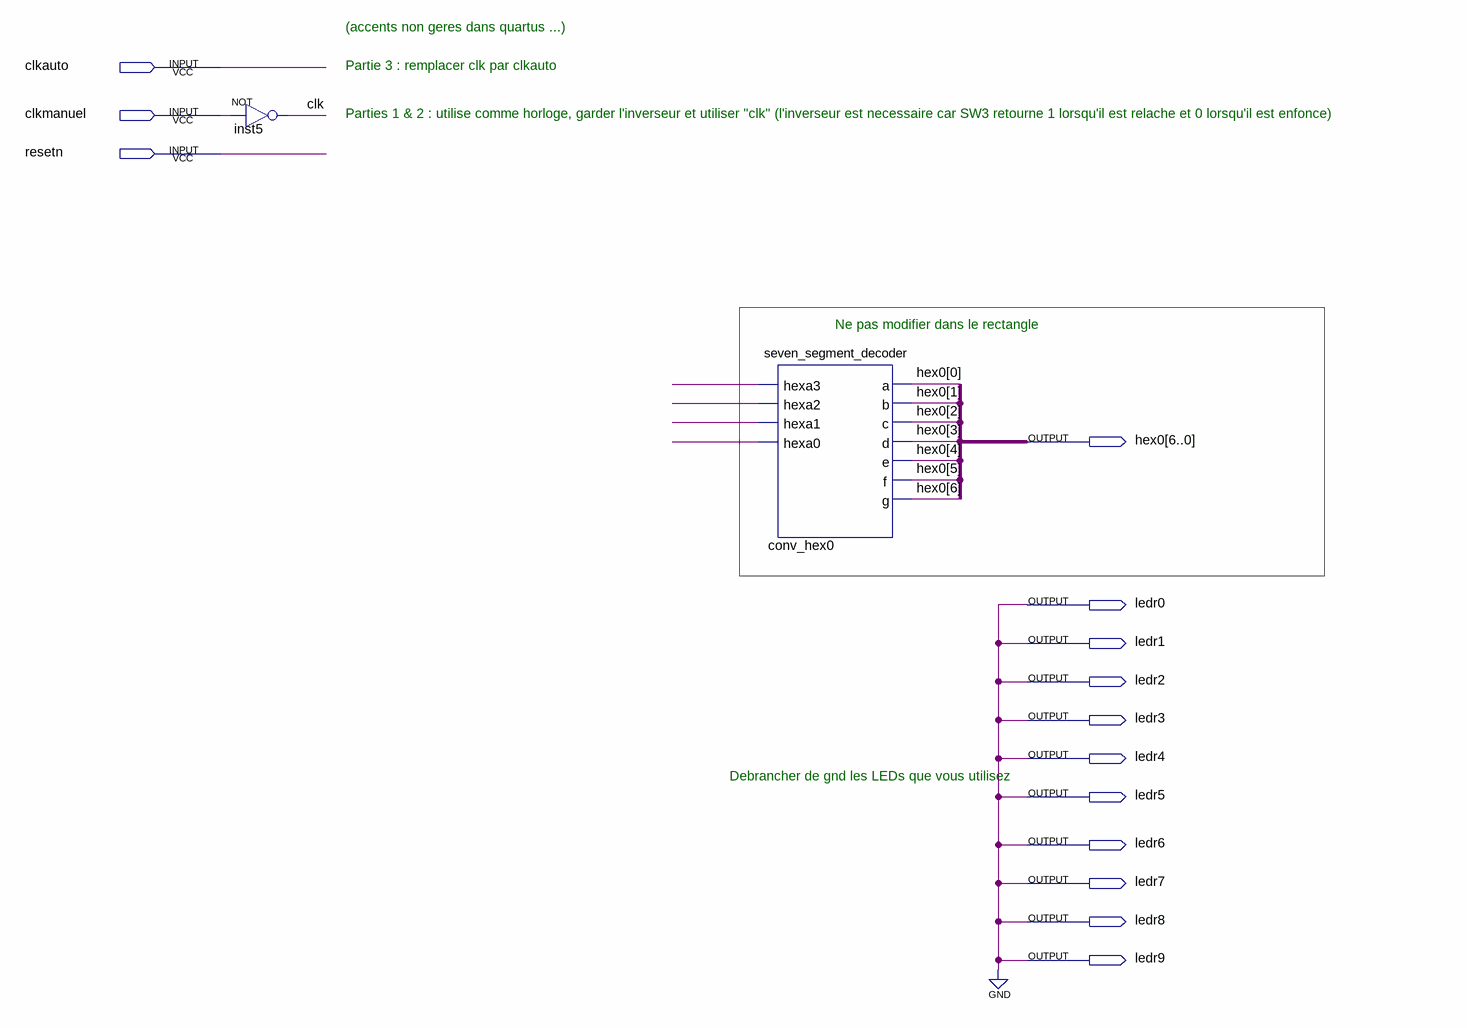
[diagram p0: schematic sheet]
// Quartus schematic design1.bdf as structural Verilog: 2 symbols, 14 pins
module design1 (
  input  clkauto,
  input  clkmanuel,
  input  resetn,
  output [6:0] hex0,
  output ledr0,
  output ledr1,
  output ledr2,
  output ledr3,
  output ledr4,
  output ledr5,
  output ledr6,
  output ledr7,
  output ledr8,
  output ledr9
);

  wire clk, undriven, undriven_2, undriven_3, undriven_4;

  not inst5 (clk, clkmanuel);
  seven_segment_decoder conv_hex0 (
    .hexa3(undriven), .hexa2(undriven_2), .hexa1(undriven_3), .hexa0(undriven_4), .a(hex0[0]), .b(hex0[1]),
    .c(hex0[2]), .d(hex0[3]), .e(hex0[4]), .f(hex0[5]), .g(hex0[6]));

  assign ledr0 = 1'b0;
  assign ledr1 = 1'b0;
  assign ledr2 = 1'b0;
  assign ledr3 = 1'b0;
  assign ledr4 = 1'b0;
  assign ledr5 = 1'b0;
  assign ledr6 = 1'b0;
  assign ledr7 = 1'b0;
  assign ledr8 = 1'b0;
  assign ledr9 = 1'b0;

  // Notes on the sheet:
  //   (accents non geres dans quartus ...)
  //   Partie 3 : remplacer clk par clkauto
  //   Parties 1 & 2 : utilise comme horloge, garder l'inverseur et utiliser "clk" (l'inverseur est necessaire car SW3 retourne 1 lorsqu'il est relache et 0 lorsqu'il est enfonce)
  //   Ne pas modifier dans le rectangle
  //   Debrancher de gnd les LEDs que vous utilisez
endmodule
